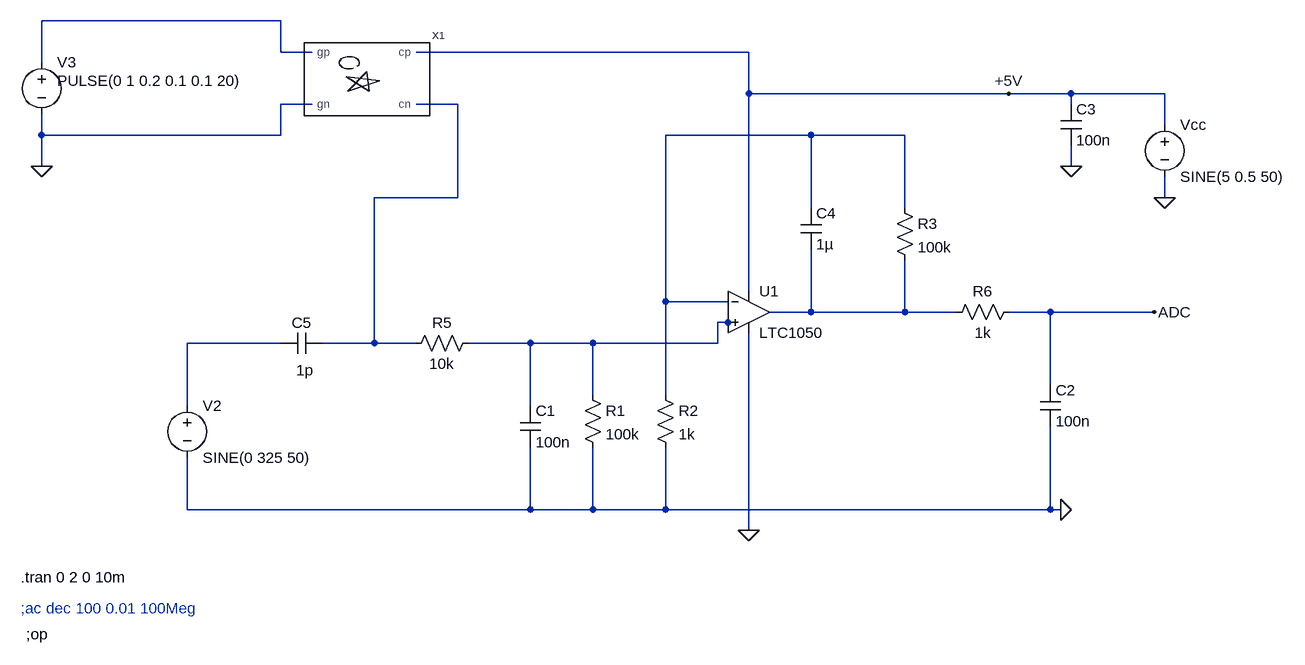
[diagram p0: schematic TPCapteurs.asc]
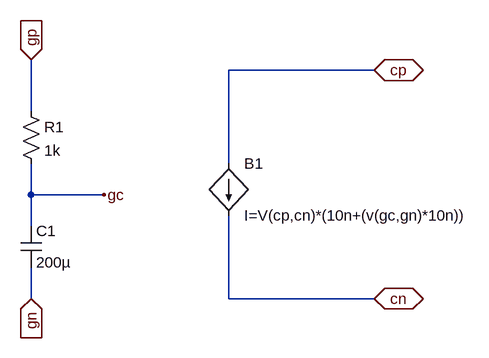
[diagram p1: sub-circuit capteur.asc]
TPCapteurs.asc, the LTspice schematic file:
Version 4
SHEET 1 1316 680
WIRE -304 -384 -672 -384
WIRE -304 -336 -304 -384
WIRE -256 -336 -304 -336
WIRE 416 -336 -96 -336
WIRE -672 -320 -672 -384
WIRE 416 -272 416 -336
WIRE 816 -272 416 -272
WIRE 912 -272 816 -272
WIRE 1056 -272 912 -272
WIRE -256 -256 -304 -256
WIRE -32 -256 -96 -256
WIRE 912 -256 912 -272
WIRE 1056 -224 1056 -272
WIRE -672 -208 -672 -240
WIRE -304 -208 -304 -256
WIRE -304 -208 -672 -208
WIRE 512 -208 288 -208
WIRE 656 -208 512 -208
WIRE -672 -160 -672 -208
WIRE 912 -160 912 -192
WIRE -32 -112 -32 -256
WIRE -32 -112 -160 -112
WIRE 1056 -112 1056 -144
WIRE 512 -96 512 -208
WIRE 656 -96 656 -208
WIRE 416 32 416 -272
WIRE 288 48 288 -208
WIRE 384 48 288 48
WIRE 512 64 512 -32
WIRE 512 64 448 64
WIRE 656 64 656 -16
WIRE 656 64 512 64
WIRE 736 64 656 64
WIRE 880 64 816 64
WIRE 1040 64 880 64
WIRE 384 80 368 80
WIRE 400 80 384 80
WIRE -304 112 -448 112
WIRE -160 112 -160 -112
WIRE -160 112 -240 112
WIRE -96 112 -160 112
WIRE 80 112 -16 112
WIRE 176 112 80 112
WIRE 368 112 368 80
WIRE 368 112 176 112
WIRE 880 176 880 64
WIRE 176 192 176 112
WIRE 288 192 288 48
WIRE -448 208 -448 112
WIRE 80 208 80 112
WIRE -448 368 -448 288
WIRE 80 368 80 272
WIRE 80 368 -448 368
WIRE 176 368 176 272
WIRE 176 368 80 368
WIRE 288 368 288 272
WIRE 288 368 176 368
WIRE 880 368 880 240
WIRE 880 368 288 368
WIRE 896 368 880 368
WIRE 416 400 416 96
FLAG 1056 -112 0
FLAG 416 400 0
FLAG 896 368 0
FLAG -672 -160 0
FLAG 1040 64 ADC
FLAG 816 -272 +5V
FLAG 912 -160 0
SYMBOL res 160 176 R0
SYMATTR InstName R1
SYMATTR Value 100k
SYMBOL res 272 176 R0
SYMATTR InstName R2
SYMATTR Value 1k
SYMBOL res 640 -112 R0
SYMATTR InstName R3
SYMATTR Value 100k
SYMBOL res 0 96 R90
WINDOW 0 0 56 VBottom 2
WINDOW 3 32 56 VTop 2
SYMATTR InstName R5
SYMATTR Value 10k
SYMBOL res 832 48 R90
WINDOW 0 0 56 VBottom 2
WINDOW 3 32 56 VTop 2
SYMATTR InstName R6
SYMATTR Value 1k
SYMBOL cap 64 208 R0
SYMATTR InstName C1
SYMATTR Value 100n
SYMBOL cap 496 -96 R0
SYMATTR InstName C4
SYMATTR Value 1µ
SYMBOL LTC1050 416 0 R0
SYMATTR InstName U1
SYMBOL capteur -176 -304 R0
SYMATTR InstName X1
SYMBOL voltage 1056 -240 R0
WINDOW 123 0 0 Left 0
WINDOW 39 0 0 Left 0
SYMATTR InstName Vcc
SYMATTR Value SINE(5 0.5 50)
SYMBOL voltage -672 -336 R0
WINDOW 3 24 44 Left 2
WINDOW 123 0 0 Left 0
WINDOW 39 0 0 Left 0
SYMATTR Value PULSE(0 1 0.2 0.1 0.1 20)
SYMATTR InstName V3
SYMBOL voltage -448 192 R0
WINDOW 123 0 0 Left 0
WINDOW 39 0 0 Left 0
SYMATTR InstName V2
SYMATTR Value SINE(0 325 50)
SYMBOL cap -240 96 R90
WINDOW 0 0 32 VBottom 2
WINDOW 3 42 27 VTop 2
SYMATTR InstName C5
SYMATTR Value 1p
SYMBOL cap 864 176 R0
SYMATTR InstName C2
SYMATTR Value 100n
SYMBOL cap 896 -256 R0
SYMATTR InstName C3
SYMATTR Value 100n
TEXT -704 472 Left 2 !.tran 0 2 0 10m
TEXT -704 520 Left 2 ;;ac dec 100 0.01 100Meg
TEXT -696 560 Left 2 !;op

capteur.asc, the sub-circuit schematic file:
Version 4
SHEET 1 880 680
WIRE 640 16 416 16
WIRE 112 80 112 0
WIRE 416 160 416 16
WIRE 112 208 112 160
WIRE 224 208 112 208
WIRE 112 256 112 208
WIRE 112 368 112 320
WIRE 416 368 416 240
WIRE 640 368 416 368
FLAG 224 208 gc
FLAG 640 16 cp
IOPIN 640 16 BiDir
FLAG 640 368 cn
IOPIN 640 368 BiDir
FLAG 112 0 gp
IOPIN 112 0 In
FLAG 112 368 gn
IOPIN 112 368 In
SYMBOL res 96 64 R0
SYMATTR InstName R1
SYMATTR Value 1k
SYMBOL cap 96 256 R0
SYMATTR InstName C1
SYMATTR Value 200µ
SYMBOL bi 416 160 R0
SYMATTR InstName B1
SYMATTR Value I=V(cp,cn)*(10n+(v(gc,gn)*10n))

The netlist it stands for:
* TPCapteurs.asc
R1 N005 0 100k
R2 N003 0 1k
R3 N003 N004 100k
R5 N005 N002 10k
R6 ADC N004 1k
C1 N005 0 100n
C4 N003 N004 1µ
XU1 N005 N003 +5V 0 N004 LTC1050  ; pins In+ In- V+ V- OUT
XX1 +5V N002 N001 0 capteur
Vcc +5V 0 SINE(5 0.5 50)
V3 N001 0 PULSE(0 1 0.2 0.1 0.1 20)
V2 N006 0 SINE(0 325 50)
C5 N002 N006 1p
C2 ADC 0 100n
C3 +5V 0 100n

* block symbol definitions
.subckt capteur cp cn gp gn
R1 gp gc 1k
C1 gc gn 200µ
B1 cp cn I=V(cp,cn)*(10n+(v(gc,gn)*10n))
.ends capteur

.tran 0 2 0 10m
* ;ac dec 100 0.01 100Meg
;op
.lib LTC.lib
.backanno
.end